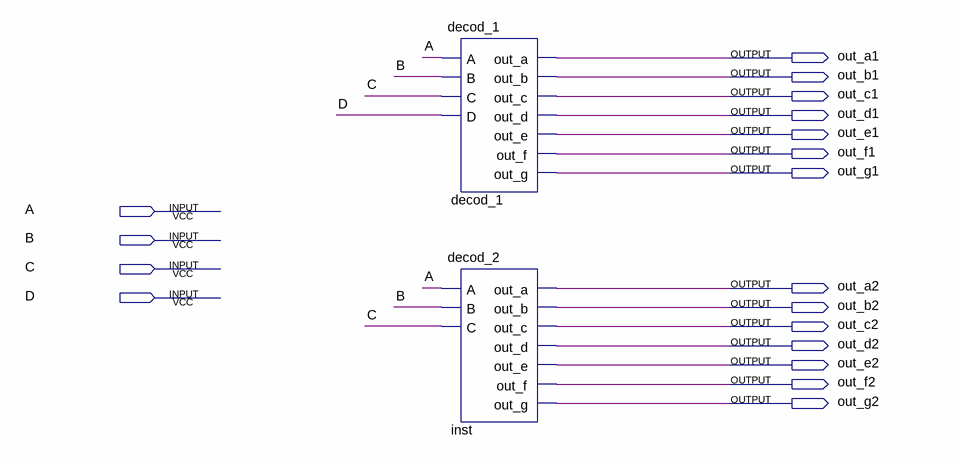
[diagram p0: schematic sheet]
// Quartus schematic circuito.bdf as structural Verilog: 2 symbols, 18 pins
module circuito (
  input  A,
  input  B,
  input  C,
  input  D,
  output out_a1,
  output out_b1,
  output out_c1,
  output out_d1,
  output out_e1,
  output out_f1,
  output out_g1,
  output out_a2,
  output out_b2,
  output out_c2,
  output out_d2,
  output out_e2,
  output out_f2,
  output out_g2
);

  decod_1 decod_1 (
    .A(A), .B(B), .C(C), .D(D), .out_a(out_a1), .out_b(out_b1), .out_c(out_c1), .out_d(out_d1),
    .out_e(out_e1), .out_f(out_f1), .out_g(out_g1));
  decod_2 inst (
    .A(A), .B(B), .C(C), .out_a(out_a2), .out_b(out_b2), .out_c(out_c2), .out_d(out_d2), .out_e(out_e2),
    .out_f(out_f2), .out_g(out_g2));
endmodule
